# Altium schematic sheet PBL4_Sch.SchDoc
size A3; SheetNumber: 1; SheetTotal: 2
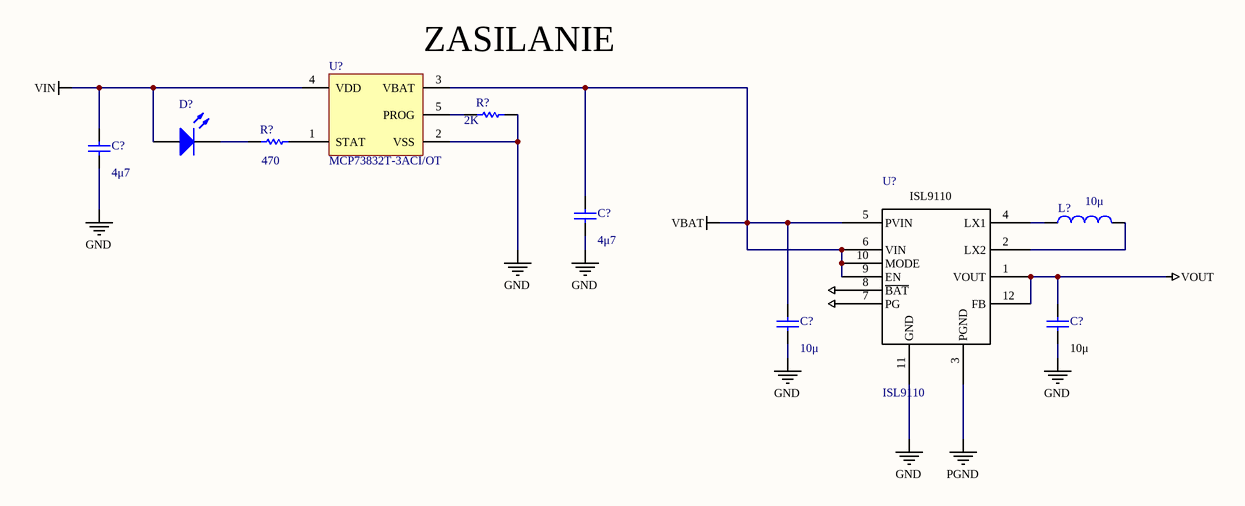
[diagram p0: PBL4_Sch.SchDoc]

## Parts
(Parts that share a designator on the sheet are numbered #1, #2 ... from top to bottom, then left to right.)
C?#1  value 4μ7  [RAD-0.3]
C?#2  value 4μ7  [RAD-0.3]
C?#3  value 10μ  [RAD-0.3]
C?#4  value 10μ  [RAD-0.3]
D?  (no value)  [LED-1]
L?  value 10μ  [0402-A]
R?#1  value 2K  [AXIAL-0.3]
R?#2  value 470  [AXIAL-0.3]
U?#1  MCP73832T-3ACI/OT  [SOT-23-OT5_M]
U?#2  ISL9110  [KM_L12.3x3C]

## Nets
GND: C?#1.2 C?#2.2 C?#3.2 C?#4.2 R?#1.2 U?#1.2(VSS) U?#2.11(GND)
NetU?#2_7: U?#2.7(PG) U?#2.8(~{BAT})
PGND: U?#2.3(PGND)
VBAT: C?#2.1 C?#3.1 U?#1.3(VBAT) U?#2.5(PVIN) U?#2.6(VIN) U?#2.9(EN) U?#2.10(MODE)
VIN: C?#1.1 D?.1(A) U?#1.4(VDD)
VOUT: C?#4.1 U?#2.1(VOUT) U?#2.12(FB)
NetD?_2: D?.2(K) R?#2.1
NetL?_1: L?.1 U?#2.4(LX1)
NetL?_2: L?.2 U?#2.2(LX2)
NetR?#1_1: R?#1.1 U?#1.5(PROG)
NetR?#2_2: R?#2.2 U?#1.1(STAT)

## Notes on the sheet
- (near U?#1) ZASILANIE

## Library data of the parts
C?#1-C?#4 = Cap: Capacitor; Published: 8-Jun-2000; LatestRevisionDate: 17-Jul-2002; LatestRevisionNote: Re-released for DXP Platform.; PackageReference: RAD-0.3; Publisher: Altium Limited; PackageDescription: Radial Cap, Thru-Hole; 2 Leads; 0.3 in Pin Spacing
D? = LED1: Typical RED GaAs LED; Published: 8-Jun-2000; LatestRevisionDate: 08-Jul-2005; LatestRevisionNote: Mech Layer 1 removed.; PackageReference: LED-1; Publisher: Altium Limited; PackageDescription: LED; 2 Leads
L? = Inductor: Code_IEC: 1005; Published: 8-Jun-2000; LatestRevisionDate: 29-May-2009; LatestRevisionNote: IPC-7351 Footprint Added.; PackageReference: 0402-A; Publisher: Altium Limited; PackageDescription: Chip Inductor; Code_JEITA: 0402
R?#1 R?#2 = Res1: Resistor; Published: 8-Jun-2000; LatestRevisionDate: 17-Jul-2002; LatestRevisionNote: Re-released for DXP Platform.; PackageReference: AXIAL-0.3; Publisher: Altium Limited; PackageDescription: Axial Device, Thru-Hole; 2 Leads; 0.3 in Pin Spacing
U?#1 = CMP-0133-00135-1: Miniature Single-Cell, Fully Integrated Li-Ion, Li-Polymer Charge Management Controller, 4.35V, 5-Pin SOT-23, Industrial Temperature, Tape and Reel; DatasheetVersion: revE, Sep-2008; PackageReference: SOT-23-OT5; PackageVersion: revBB, Aug-2009; Code_IPC: SOT23-5; PackageDescription: 5-Lead Plastic Small Outline Transistor (OT) [SOT-23]
U?#2 = KM_ISL9110: L12.3x3C